# Altium project Noise Toaster.PrjPcb (part 2 of 3)

## Sheet Audio Amplifier.SchDoc: Audio Amplifier
size Letter; SheetNumber: 4; SheetTotal: 10
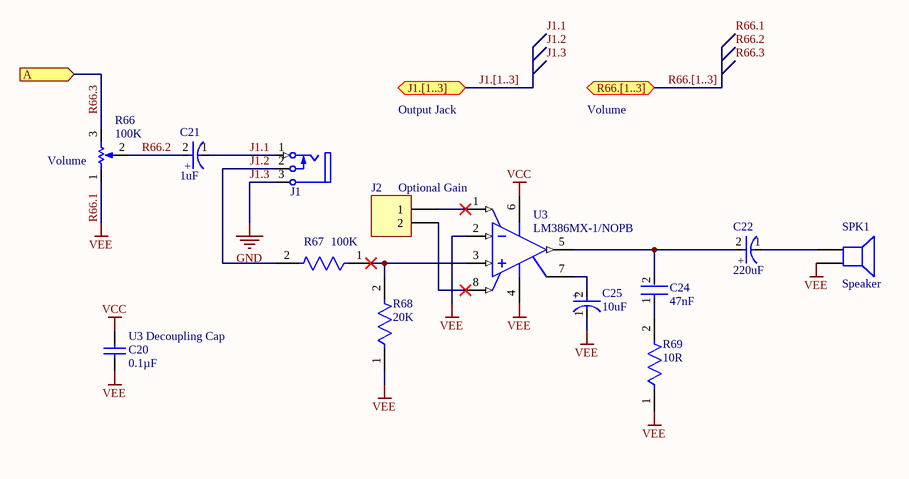
[diagram p5: Audio Amplifier.SchDoc]

### Parts
C20  Capacitance: 0.1µF  [SAMS-C0603-2_M]  (hidden comment: CL10B104KB8NNNC)
C21  Capacitance: 1uF  [FP-OS-CON-SMT-A5-MFG]  (hidden comment: EEE-1HA010NR)
C22  Capacitance: 220uF  [FP-SD-MFG]
C24  Capacitance: 47nF  [FP-CL10-IPC_A]  (hidden comment: CL10B473KB8NNNC)
C25  Capacitance: 10uF  [FP-OS-CON-SMT-A5-MFG]  (hidden comment: 865080440002)
J1  Phonejack2 TN  [JACK/6-V3A]  (value not drawn)  (graphical)
J2  Optional Gain  [HDR1X2]
R66  Volume  value 100K  [VR5]  (graphical)
R67  Resistance: 100K  [FP-ESR03-IPC_B]  (hidden comment: ESR03EZPJ104)
R68  Resistance: 20K  [FP-ESR03-IPC_B]  (hidden comment: ESR03EZPJ203)
R69  Resistance: 10R  [FP-ESR03-IPC_B]  (hidden comment: ESR03EZPJ100)
SPK1  Speaker  [PIN2]
U3  LM386MX-1/NOPB  [TI-D8_L]

### Ports
A (in), J1.[1..3] (bidir), R66.[1..3] (bidir)

### Nets
GND: J1.3(S)  [also labelled J1.3]
VCC: C20.2 U3.6(VS)
VEE: C20.1 C25.1(C) R66.1(TOP) R68.1 R69.1 SPK1.2 U3.2(IN-) U3.4(GND)  [also labelled R66.1]
J1.1: C21.1(C) J1.1(T)
J1.2: J1.2(TN) R67.2
R66.2: C21.2(A) R66.2(TAP)
R66.3: R66.3(BOT) ; port A  [project net A]
NetC22_1: C22.1(C) SPK1.1
NetC22_2: C22.2(A) C24.2 U3.5(VOUT)
NetC24_1: C24.1 R69.2
NetC25_2: C25.2(A) U3.7(BYPASS)
NetJ2_1: J2.1 U3.1(GAIN)
NetJ2_2: J2.2 U3.8(GAIN)
NetR67_1: R67.1 R68.2 U3.3(IN+)

### Buses and harness runs
bus J1.[1..3] = port J1.[1..3]
bus R66.[1..3] = port R66.[1..3]

### Notes on the sheet
- Output Jack
- Volume
- (near C20) U3 Decoupling Cap
- Labels drawn without touching a wire or pin: J1.1, J1.2, J1.3, R66.1, R66.2, R66.3
- (in symbol CMP-05427-000006-1) +
- (in symbol CMP-05427-000158-1) +

### Library data of the parts
C20 = CMP-2000-05332-1: Multi-layer Ceramic Capacitor, -55 to 125 degC, 2-Pin SMD (0603), RoHS, Tape and Reel; Manufacturer: Samsung Electro-Mechanics; Rated Voltage: 50V; Dielectric: X7R; Tolerance (%): ±10%; Case Size/Dimension: 0603; Datasheet URL: https://datasheet.ciiva.com/29198/456651-da-01-en-vs-kondensator-0605-29198839.pdf; Manufacturer URL: http://www.samsungsem.com/global/index.jsp; Datasheet Version: Nov-10
C21 = CMP-05427-000158-1: CAP ALUM POLY 10UF 20% 10V SMD Non-Polarized; Manufacturer: Panasonic; Ripple Current: 700mA; Polarity: Polar; ESR (Equivalent Series Resistance): 220mR; Leakage Current: 50uA; Material: Polymer; Voltage Rating: 50V; Life (Hours): 2000Hour; Dissipation Factor: 10%; Height - Seated (Max): 0.217inch; Height: 5.4mm; Length: 5.4mm; Case/Package: Radial; Number of Pins: 5; Voltage: 10V; Termination: SMD/SMT; Packaging: Tape and Reel; Mount: Surface Mount; Min Operating Temperature: -55°C; Voltage Rating (DC): 10V; Construction: Cylindrical; Series: OS-CON™, SVP; Max Operating Temperature: 105°C; Radiation Hardening: No; Diameter: 4mm; REACH SVHC: No SVHC; Ripple Current (AC): 700mA; RoHS Compliant: Yes; Tolerance: 20%; Package Quantity: 2000; Lead Free: Lead Free; Supplier 1: Mouser; Supplier Part Number 1: 667-EEE-1HA010NR; Manufacturer Part Number: EEE-1HA010NR; RoHS: Yes; Category: Aluminum Electrolytic Capacitors; Stock 1: 106; Pricing 1: 1=0.49000, 10=0.33900, 50=0.23700, 100=0.20300, 1000=0.15300, 10000=0.12100 (USD); Contact Plating: Tin; Width: 650um; ComponentLink1URL: https://datasheet.ciiva.com/24228/aba0000ce2-40801-24228231.pdf?src-supplier=Mouser; ComponentLink1Description: https://datasheet.ciiva.com/24228/aba0000ce2-40801-24228231.pdf?src-supplier=Mouser; ComponentLink2URL: https://datasheet.ciiva.com/14604/70255710-14604079.pdf?src-supplier=Allied+Electronics; ComponentLink2Description: https://datasheet.ciiva.com/14604/70255710-14604079.pdf?src-supplier=Allied+Electronics; ComponentLink3URL: https://datasheet.ciiva.com/14597/70255710-14597097.pdf?src-supplier=Allied+Electronics; ComponentLink3Description: https://datasheet.ciiva.com/14597/70255710-14597097.pdf?src-supplier=Allied+Electronics; ComponentLink4URL: https://datasheet.ciiva.com/16396/aba0000ce2-16396566.pdf?src-supplier=Future+Electronics; ComponentLink4Description: https://datasheet.ciiva.com/16396/aba0000ce2-16396566.pdf?src-supplier=Future+Electronics; ComponentLink5URL: https://datasheet.ciiva.com/30244/11aba0000ce2-30244199.pdf?src-supplier=Onlinecomponents.com; ComponentLink5Description: https://datasheet.ciiva.com/30244/11aba0000ce2-30244199.pdf?src-supplier=Onlinecomponents.com
C22 = CMP-05427-000006-1: Manufacturer: Nichicon; Manufacturer Part Number: UCL1C221MCL1GS; Material: Aluminium; Tolerance: 20%; Voltage Rating: 16V; Ripple Current: 600mA; Impedance: 160mR; Leakage Current: 3uA; Life (Hours): 2000Hour; Dissipation Factor: 0.16%; Supplier 1: Arrow Electronics; Supplier Part Number 1: UCL1C221MCL1GS; RoHS: Yes; Category: Aluminum Electrolytic Capacitors; Stock 1: 77400; Pricing 1: 900=0.22420 (USD); Mount: Surface Mount; Case/Package: Radial; Number of Pins: 2; Dielectric Material: Aluminium; Min Operating Temperature: -55°C; Max Operating Temperature: 105°C; Package Quantity: 1; Packaging: Tape and Reel; Voltage Rating (DC): 16V; Termination: SMD/SMT; Ripple Current (AC): 600mA; ESR (Equivalent Series Resistance): 160mR; Series: CL; Construction: Cylindrical; Diameter: 6.3mm; Length: 7.7mm; Height: 7.7mm; Height - Seated (Max): 0.303inch; Radiation Hardening: No; REACH SVHC: No SVHC; Lead Free: Lead Free; RoHS Compliant: Yes; ComponentLink1URL: https://datasheet.ciiva.com/101/e-cl-101761.pdf?src-supplier=Digi-Key; ComponentLink1Description: https://datasheet.ciiva.com/101/e-cl-101761.pdf?src-supplier=Digi-Key; ComponentLink2URL: https://datasheet.ciiva.com/101/e-cl-101762.pdf?src-supplier=Digi-Key; ComponentLink2Description: https://datasheet.ciiva.com/101/e-cl-101762.pdf?src-supplier=Digi-Key; ComponentLink3URL: https://datasheet.ciiva.com/101/e-cl-101763.pdf?src-supplier=Digi-Key; ComponentLink3Description: https://datasheet.ciiva.com/101/e-cl-101763.pdf?src-supplier=Digi-Key; ComponentLink4URL: https://datasheet.ciiva.com/11684/e-cl-11684891.pdf?src-supplier=Avnet; ComponentLink4Description: https://datasheet.ciiva.com/11684/e-cl-11684891.pdf?src-supplier=Avnet; ComponentLink5URL: https://datasheet.ciiva.com/16502/e-cl-16502283.pdf?src-supplier=Future+Electronics; ComponentLink5Description: https://datasheet.ciiva.com/16502/e-cl-16502283.pdf?src-supplier=Future+Electronics
C24 = CMP-13271-001056-1: Cap Ceramic 47nF 50V X7R ±10% Pad SMD 0603 +125°C T/R; Dielectric: Y5V; Packaging: Tape and Reel; Material: Ceramic; Max Operating Temperature: 125°C; Case/Package: 0603; Voltage Rating: 50V; Tolerance: 10%; Voltage: 50V; Height: 0.8mm; Mount: Surface Mount; Min Operating Temperature: -55°C; Package Quantity: 4000; Length: 1.6mm; Depth: 0.8mm; Lead Free: Lead Free; Case Code (Metric): 1608; Width: 0.031inch; Thickness: 0.035inch; Case Code (Imperial): 0603; Radiation Hardening: No; Voltage Rating (DC): 50V; Contact Plating: Tin
C25 = CMP-05427-000158-1: CAP ALUM POLY 10UF 20% 10V SMD; Manufacturer: Wurth Electronics; Voltage Rating: 25V; Polarity: Polar; Ripple Current: 85mA; Impedance: 2.1R; Life (Hours): 2000Hour; Supplier 1: RSComponents; Supplier Part Number 1: 8391799P; Manufacturer Part Number: 865080440002; RoHS: Yes; Category: Aluminum Electrolytic Capacitors; Stock 1: 1; Pricing 1: 25=0.18500, 125=0.12700, 250=0.11600, 500=0.10400 (USD); Mount: Surface Mount; Case/Package: Radial; Min Operating Temperature: -55°C; Max Operating Temperature: 105°C; Package Quantity: 2000; Packaging: Cut Tape; Ripple Current (AC): 85mA; Tolerance: 20%; Voltage Rating (DC): 25V; Diameter: 4mm; Height: 5.5mm; Height - Seated (Max): 0.217inch; REACH SVHC: Unknown; RoHS Compliant: Yes; ComponentLink1URL: http://www.farnell.com/datasheets/1880137.pdf?src-supplier=Farnell; ComponentLink1Description: http://www.farnell.com/datasheets/1880137.pdf?src-supplier=Farnell; ComponentLink2URL: http://www.farnell.com/datasheets/1880137.pdf?src-supplier=Element14; ComponentLink2Description: http://www.farnell.com/datasheets/1880137.pdf?src-supplier=Element14; ComponentLink3URL: https://katalog.we-online.de/pbs/datasheet/865080440002.pdf?src-supplier=Digi-Key; ComponentLink3Description: https://katalog.we-online.de/pbs/datasheet/865080440002.pdf?src-supplier=Digi-Key; ComponentLink4URL: http://katalog.we-online.de/pbs/datasheet/865080440002.pdf?src-supplier=Digi-Key; ComponentLink4Description: http://katalog.we-online.de/pbs/datasheet/865080440002.pdf?src-supplier=Digi-Key
J1 = Phonejack2 TN: Jack Socket, 1/4" [6.5mm], Thru-Hole, Vertical, 2-Conductor with Tip closed; PackageDocument: 2003; PCB_Layout: Complies with manufacturer's recommendation.; DrillAndSlotSize: Corresponds to nominal value.; ComponentLink1URL: http://www.cliffuk.co.uk/; ComponentLink1Description: Manufacturer Link; LatestRevisionDate: 15-Jul-2004; LatestRevisionNote: Component Replaced & renamed from "Phonejack".; DatasheetDocument: 2003; PackageReference: S1VS_SNB; Publisher: Altium Limited
J2 = Header 2: Header, 2-Pin; LatestRevisionDate: 17-Jul-2002; LatestRevisionNote: Re-released for DXP Platform.; Publisher: Altium Limited
R66 = RPot: Potentiometer; Sim Note: Enter the Resistance value and the set point into parameter fields.; Set Position: 0.5; Published: 8-Jun-2000; LatestRevisionDate: 17-Jul-2002; LatestRevisionNote: Re-released for DXP Platform.; PackageReference: VR5; Publisher: Altium Limited; PackageDescription: Variable Resistor, Thru-Hole; 3 Leads
R67 = CMP-08839-029521-1: 100kΩ ±5% 0.25W 0603 Anti-Surge Chip Resistor AEC-Q200; Power Rating: 200mW; Max Power Dissipation: 250mW; Temperature Coefficient: 200ppm/°C; Length: 0.063inch; Case Code (Imperial): 0603; Case/Package: 0603; Resistor Type: Thick Film; Features: Automotive AEC-Q200; Package Quantity: 1; Width: 0.031inch; Packaging: Cut Tape; Min Operating Temperature: -55°C; Series: ESR; RoHS Compliant: Yes; Size Code: 0603; Tolerance: 5%; Height: 0.022inch; Max Operating Temperature: 155°C; Lead Free: Lead Free; Case Code (Metric): 1608; Number of Terminations: 2
R68 = CMP-08839-028532-1: 20kΩ ±5% 0.25W 0603 Anti-Surge Chip Resistor AEC-Q200; Temperature Coefficient: 200ppm/°C; Max Power Dissipation: 250mW; Resistor Type: Thick Film; Number of Terminations: 2; Height: 0.022inch; Package Quantity: 5000; Case/Package: 0603; Packaging: Cut Tape; Case Code (Imperial): 0603; Width: 0.031inch; Max Operating Temperature: 155°C; Length: 0.063inch; Features: Automotive AEC-Q200; Case Code (Metric): 1608; Tolerance: 5%; Series: ESR; Min Operating Temperature: -55°C
R69 = CMP-08839-028230-1: 10Ω ±5% 0.25W 0603 Anti-Surge Chip Resistor AEC-Q200; Max Power Dissipation: 250mW; Temperature Coefficient: 200ppm/°C; Features: Automotive AEC-Q200; Packaging: Tape and Reel; Series: ESR; Tolerance: 5%; Min Operating Temperature: -55°C; Case Code (Imperial): 0603; RoHS Compliant: Yes; Resistor Type: Thick Film; Case/Package: 0603; Max Operating Temperature: 155°C; Number of Terminations: 2; Case Code (Metric): 1608
SPK1 = Speaker: Loudspeaker; Published: 24-Mar-1999; LatestRevisionDate: 17-Jul-2002; LatestRevisionNote: Re-released for DXP Platform.; PackageReference: PIN2; Publisher: Altium Limited
U3 = CMP-0994-00003-1: Low Voltage Audio Power Amplifier, 0 to 70 degC, 8-pin SOIC (D8), Green (RoHS & no Sb/Br); Manufacturer: Texas Instruments; SubFamily: Mid/High-Power Amplifier; Max. Number of Speaker Outputs: 1; Input Type: Analog; Mounting Technology: Surface Mount; ComponentLink1Description: Manufacturer URL; PackageVersion: 4040047-3/M, 06/2011; ComponentLink2URL: http://www.ti.com/general/docs/lit/getliterature.tsp?genericPartNumber=LM386&fileType=pdf; ComponentLink1URL: http://www.ti.com/; PackageDescription: 8-Pin Plastic Small Outline, Body 4.9 x 3.9 mm, Pitch 1.27 mm; PartNumber: LM386MX-1/NOPB; ComponentLink3Description: Package Specification; Eco-Plan: Green (RoHS & no Sb/Br); DatasheetVersion: SNAS545A; Code_JEDEC: MS-012; ComponentLink3URL: http://www.ti.com/litv/pdf/msoi002j; ComponentLink2Description: Datasheet; PackageReference: D8

## Sheet VCO.SchDoc: Voltage Controlled Oscillator
size Letter; SheetNumber: 9; SheetTotal: 10
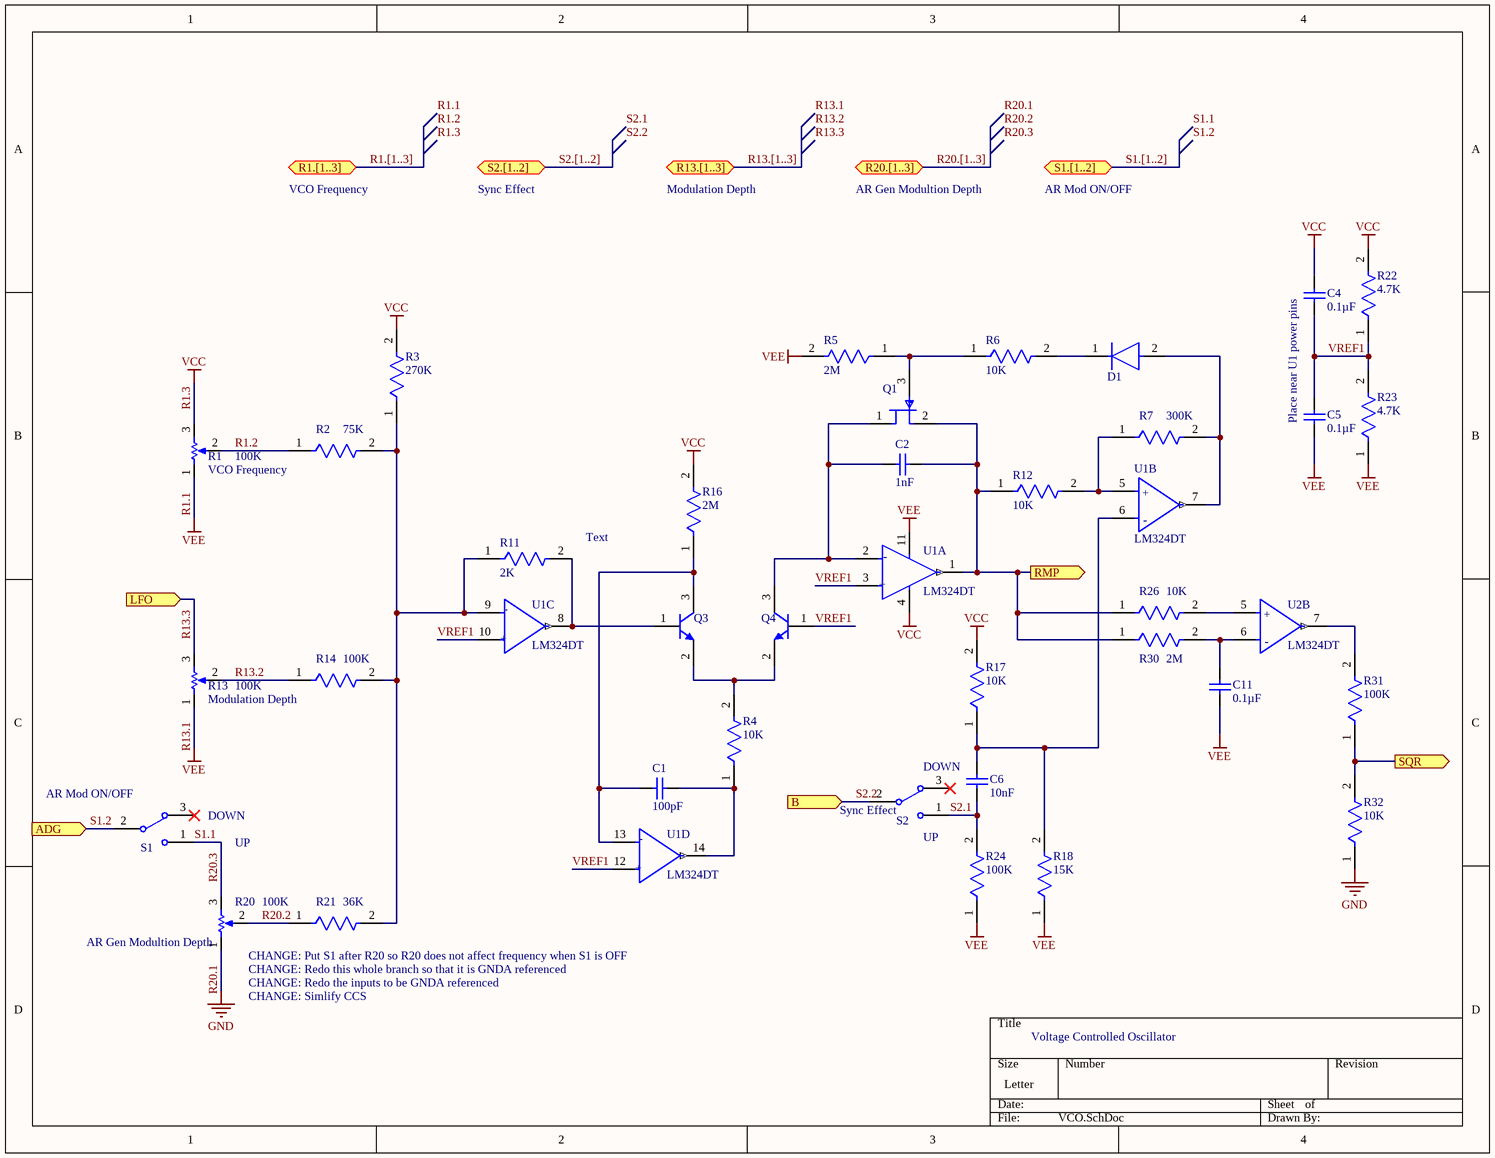
[diagram p6: VCO.SchDoc]

### Parts
C1  Capacitance: 100pF  [CAPC1608X90X35NL10T15]  (hidden comment: 885012206077‎)
C2  Capacitance: 1nF  [CAPC1608X90X35NL10T15]  (hidden comment: 885012206083‎)
C4  Capacitance: 0.1µF  [SAMS-C0603-2_M]  (hidden comment: CL10B104KB8NNNC)
C5  Capacitance: 0.1µF  [SAMS-C0603-2_M]  (hidden comment: CL10B104KB8NNNC)
C6  Capacitance: 10nF  [CAPC1608X90X35NL10T15]  (hidden comment: 885012206089)
C11  Capacitance: 0.1µF  [SAMS-C0603-2_M]  (hidden comment: CL10B104KB8NNNC)
D1  1N4448WS-7-F  [FP-SOD323-MFG]  (value not drawn)
Q1  MMBFJ113  [FP-318BM-IPC_C]  (value not drawn)
Q3  MMBT3904LT1G  [ONSC-SOT-23-3-318-08_V]  (value not drawn)
Q4  MMBT3904LT1G  [ONSC-SOT-23-3-318-08_V]  (value not drawn)
R1  VCO Frequency  value 100K  [VR5]  (graphical)
R2  Resistance: 75K  [FP-ESR03-IPC_B]  (hidden comment: ESR03EZPJ753)
R3  Resistance: 270K  [FP-ESR03-IPC_B]  (hidden comment: ESR03EZPJ274)
R4  Resistance: 10K  [FP-ESR03-IPC_B]  (hidden comment: ESR03EZPJ103)
R5  Resistance: 2M  [FP-ESR03-IPC_B]  (hidden comment: ESR03EZPJ205)
R6  Resistance: 10K  [FP-ESR03-IPC_B]  (hidden comment: ESR03EZPJ103)
R7  Resistance: 300K  [FP-ESR03-IPC_B]  (hidden comment: ESR03EZPJ304)
R11  Resistance: 2K  [FP-ESR03-IPC_B]  (hidden comment: ESR03EZPJ202)
R12  Resistance: 10K  [FP-ESR03-IPC_B]  (hidden comment: ESR03EZPJ103)
R13  Modulation Depth  value 100K  [VR5]  (graphical)
R14  Resistance: 100K  [FP-ESR03-IPC_B]  (hidden comment: ESR03EZPJ104)
R16  Resistance: 2M  [FP-ESR03-IPC_B]  (hidden comment: ESR03EZPJ205)
R17  Resistance: 10K  [FP-ESR03-IPC_B]  (hidden comment: ESR03EZPJ103)
R18  Resistance: 15K  [FP-ESR03-IPC_B]  (hidden comment: ESR03EZPJ153)
R20  AR Gen Modultion Depth  value 100K  [VR5]  (graphical)
R21  Resistance: 36K  [FP-ESR03-IPC_B]  (hidden comment: ESR03EZPJ363)
R22  Resistance: 4.7K  [FP-ESR03-IPC_B]  (hidden comment: ESR03EZPJ472)
R23  Resistance: 4.7K  [FP-ESR03-IPC_B]  (hidden comment: ESR03EZPJ472)
R24  Resistance: 100K  [FP-ESR03-IPC_B]  (hidden comment: ESR03EZPJ104)
R26  Resistance: 10K  [FP-ESR03-IPC_B]  (hidden comment: ESR03EZPJ103)
R30  Resistance: 2M  [FP-ESR03-IPC_B]  (hidden comment: ESR03EZPJ205)
R31  Resistance: 100K  [FP-ESR03-IPC_B]  (hidden comment: ESR03EZPJ104)
R32  Resistance: 10K  [FP-ESR03-IPC_B]  (hidden comment: ESR03EZPJ103)
S1  AR Mod ON/OFF  [HDR1X3]
S2  Sync Effect  [HDR1X3]
U1  LM324DT  [FP-SO-14-MFG]  (parts A,B,C,D of 4)
U2  LM324DT  [FP-SO-14-MFG]  (part B of 4)

### Ports
ADG (in), B (in), LFO (in), R1.[1..3] (bidir), R13.[1..3] (bidir), R20.[1..3] (bidir), RMP (out), S1.[1..2] (bidir), S2.[1..2] (bidir), SQR (out)

### Nets
GND: R20.1(TOP) R32.1  [also labelled R20.1]
VCC: C4.1 R1.3(BOT) R3.2 R16.2 R17.2 R22.2 U1.4(VCC+)  [also labelled R1.3]
VEE: C5.2 C11.1 R1.1(TOP) R5.2 R13.1(TOP) R18.1 R23.1 R24.1 U1.11(VCC-)  [also labelled R1.1, R13.1]
R1.2: R1.2(TAP) R2.1
R13.2: R13.2(TAP) R14.1
R13.3: R13.3(BOT) ; port LFO  [project net LFO]
R20.2: R20.2(TAP) R21.1
R20.3: R20.3(BOT) S1.1  [also labelled S1.1]
RMP: C2.2 Q1.2(S) R12.1 R26.1 R30.1 U1.1(Output_1) ; port RMP
S1.2: S1.2 ; port ADG  [project net ADG]
S2.1: C6.1 R24.2 S2.1
S2.2: S2.2 ; port B  [project net B]
S3.3: R31.1 R32.2 ; port SQR
VREF1: C4.2 C5.1 Q4.1(B) R22.1 R23.2 U1.3(Non-Inverting_Input_1) U1.10(Non-Inverting_Input_3) U1.12(Non-Inverting_Input_4)
NetC1_1: C1.1 Q3.3(C) R16.1 U1.13(Inverting_Input_4)
NetC1_2: C1.2 R4.1 U1.14(Output_4)
NetC2_1: C2.1 Q1.1(D) Q4.3(C) U1.2(Inverting_Input_1)
NetC6_2: C6.2 R17.1 R18.2 U1.6(Inverting_Input_2)
NetC11_2: C11.2 R30.2 U2.6(Inverting_Input_2)
NetD1_1: D1.1(C) R6.2
NetD1_2: D1.2(A) R7.2 U1.7(Output_2)
NetQ1_3: Q1.3(G) R5.1 R6.1
NetQ3_1: Q3.1(B) R11.2 U1.8(Output_3)
NetQ3_2: Q3.2(E) Q4.2(E) R4.2
NetR2_2: R2.2 R3.1 R11.1 R14.2 R21.2 U1.9(Inverting_Input_3)
NetR7_1: R7.1 R12.2 U1.5(Non-Inverting_Input_2)
NetR26_2: R26.2 U2.5(Non-Inverting_Input_2)
NetR31_2: R31.2 U2.7(Output_2)

Not connected (* = marked no-connect by the designer): S1 3*; S2 3*

### Buses and harness runs
bus R1.[1..3] = port R1.[1..3]
bus R13.[1..3] = port R13.[1..3]
bus R20.[1..3] = port R20.[1..3]
bus S1.[1..2] = port S1.[1..2]
bus S2.[1..2] = port S2.[1..2]

### Notes on the sheet
- VCO Frequency
- Sync Effect
- Modulation Depth
- AR Gen Modultion Depth
- AR Mod ON/OFF
- Place near U1 power pins
- (near R11) Text
- (near S2) DOWN
- (near S1) DOWN
- UP
- (near S2) UP
- CHANGE: Put S1 after R20 so R20 does not affect frequency when S1 is OFF
- CHANGE: Redo this whole branch so that it is GNDA referenced
- CHANGE: Redo the inputs to be GNDA referenced
- CHANGE: Simlify CCS
- Labels drawn without touching a wire or pin: R1.1, R1.2, R1.3, R13.1, R13.2, R13.3, R20.1, R20.2, R20.3, S1.1, S1.2, S2.1, S2.2
- (in symbol CMP-12131-000005-1, part A) -; +
- (in symbol CMP-12131-000005-1, part B) +; -
- (in symbol CMP-12131-000005-1, part C) -; +
- (in symbol CMP-12131-000005-1, part D) -; +

### Library data of the parts
C1 = CMP-2006-02891-1: Part Number: 885012206083‎; Manufacturer: Wurth; Manufacturer Part Number: 885012206083; Voltage Rating: 50V; Dielectric: X7R; Tolerance: 10%; Supplier 1: RSComponents; Supplier Part Number 1: 8392938; RoHS: Yes; Category: Ceramic Capacitors; Stock 1: 1; Pricing 1: 100=0.02300, 500=0.02000, 2000=0.01800, 4000=0.01600, 8000=0.00900 (USD); Mount: Surface Mount; Case/Package: 0603; Case Code (Metric): 1608; Case Code (Imperial): 0603; Min Operating Temperature: -55°C; Max Operating Temperature: 125°C; Packaging: Cut Tape; Voltage Rating (DC): 50V; Length: 0.063inch; Width: 0.031inch; Thickness: 0.037inch; REACH SVHC: Unknown; RoHS Compliant: Yes; ComponentLink1URL: http://www.farnell.com/datasheets/1958479.pdf?src-supplier=Farnell; ComponentLink1Description: http://www.farnell.com/datasheets/1958479.pdf?src-supplier=Farnell; ComponentLink2URL: http://www.farnell.com/datasheets/1958479.pdf?src-supplier=Element14; ComponentLink2Description: http://www.farnell.com/datasheets/1958479.pdf?src-supplier=Element14; ComponentLink3URL: https://katalog.we-online.de/pbs/datasheet/885012206083.pdf?src-supplier=Digi-Key; ComponentLink3Description: https://katalog.we-online.de/pbs/datasheet/885012206083.pdf?src-supplier=Digi-Key; ComponentLink4URL: http://www.farnell.com/datasheets/1958479.pdf?src-supplier=Newark; ComponentLink4Description: http://www.farnell.com/datasheets/1958479.pdf?src-supplier=Newark; Supplier 2: RSComponents; Supplier Part Number 2: 8392916; Stock 2: 1; Pricing 2: 100=0.02600, 500=0.01800, 2000=0.01600, 4000=0.01000, 8000=0.01000 (USD); ComponentLink5URL: http://www.farnell.com/datasheets/1958478.pdf?src-supplier=Farnell; ComponentLink5Description: http://www.farnell.com/datasheets/1958478.pdf?src-supplier=Farnell; ComponentLink6URL: http://www.farnell.com/datasheets/1958478.pdf?src-supplier=Element14; ComponentLink6Description: http://www.farnell.com/datasheets/1958478.pdf?src-supplier=Element14; ComponentLink7URL: https://katalog.we-online.de/pbs/datasheet/885012206077.pdf?src-supplier=Digi-Key; ComponentLink7Description: https://katalog.we-online.de/pbs/datasheet/885012206077.pdf?src-supplier=Digi-Key; ComponentLink8URL: http://www.farnell.com/datasheets/1958478.pdf?src-supplier=Newark; ComponentLink8Description: http://www.farnell.com/datasheets/1958478.pdf?src-supplier=Newark
C2 = CMP-2006-02891-1: Manufacturer: Wurth; Voltage Rating: 50V; Dielectric: X7R; Tolerance: 10%; Part Number: 885012206083‎; Supplier 1: RSComponents; Supplier Part Number 1: 8392938; Manufacturer Part Number: 885012206083; RoHS: Yes; Category: Ceramic Capacitors; Stock 1: 1; Pricing 1: 100=0.02300, 500=0.02000, 2000=0.01800, 4000=0.01600, 8000=0.00900 (USD); Mount: Surface Mount; Case/Package: 0603; Case Code (Metric): 1608; Case Code (Imperial): 0603; Min Operating Temperature: -55°C; Max Operating Temperature: 125°C; Packaging: Cut Tape; Voltage Rating (DC): 50V; Length: 0.063inch; Width: 0.031inch; Thickness: 0.037inch; REACH SVHC: Unknown; RoHS Compliant: Yes; ComponentLink1URL: http://www.farnell.com/datasheets/1958479.pdf?src-supplier=Farnell; ComponentLink1Description: http://www.farnell.com/datasheets/1958479.pdf?src-supplier=Farnell; ComponentLink2URL: http://www.farnell.com/datasheets/1958479.pdf?src-supplier=Element14; ComponentLink2Description: http://www.farnell.com/datasheets/1958479.pdf?src-supplier=Element14; ComponentLink3URL: https://katalog.we-online.de/pbs/datasheet/885012206083.pdf?src-supplier=Digi-Key; ComponentLink3Description: https://katalog.we-online.de/pbs/datasheet/885012206083.pdf?src-supplier=Digi-Key; ComponentLink4URL: http://www.farnell.com/datasheets/1958479.pdf?src-supplier=Newark; ComponentLink4Description: http://www.farnell.com/datasheets/1958479.pdf?src-supplier=Newark
C4 C5 C11 = CMP-2000-05332-1: as C20 on sheet Audio Amplifier; Case Size/Dimension: 0603; Datasheet URL: https://datasheet.ciiva.com/29198/456651-da-01-en-vs-kondensator-0605-29198839.pdf; Manufacturer URL: http://www.samsungsem.com/global/index.jsp; Datasheet Version: Nov-10
C6 = CMP-2006-02891-1: Manufacturer: Wurth Electronics; Voltage Rating: 50V; Dielectric: X7R; Tolerance: 10%; ComponentLink1URL: http://www.farnell.com/datasheets/1958479.pdf?src-supplier=Farnell; ComponentLink1Description: http://www.farnell.com/datasheets/1958479.pdf?src-supplier=Farnell; ComponentLink2URL: http://www.farnell.com/datasheets/1958479.pdf?src-supplier=Element14; ComponentLink2Description: http://www.farnell.com/datasheets/1958479.pdf?src-supplier=Element14; ComponentLink3URL: https://katalog.we-online.de/pbs/datasheet/885012206083.pdf?src-supplier=Digi-Key; ComponentLink3Description: https://katalog.we-online.de/pbs/datasheet/885012206083.pdf?src-supplier=Digi-Key; ComponentLink4URL: http://www.farnell.com/datasheets/1958479.pdf?src-supplier=Newark; ComponentLink4Description: http://www.farnell.com/datasheets/1958479.pdf?src-supplier=Newark; ComponentLink5URL: http://www.farnell.com/datasheets/1958478.pdf?src-supplier=Farnell; ComponentLink5Description: http://www.farnell.com/datasheets/1958478.pdf?src-supplier=Farnell; ComponentLink6URL: http://www.farnell.com/datasheets/1958478.pdf?src-supplier=Element14; ComponentLink6Description: http://www.farnell.com/datasheets/1958478.pdf?src-supplier=Element14; ComponentLink7URL: https://katalog.we-online.de/pbs/datasheet/885012206077.pdf?src-supplier=Digi-Key; ComponentLink7Description: https://katalog.we-online.de/pbs/datasheet/885012206077.pdf?src-supplier=Digi-Key; ComponentLink8URL: http://www.farnell.com/datasheets/1958478.pdf?src-supplier=Newark; ComponentLink8Description: http://www.farnell.com/datasheets/1958478.pdf?src-supplier=Newark; Supplier 1: RSComponents; Supplier Part Number 1: 8392950; Manufacturer Part Number: 885012206089; RoHS: Yes; Category: Ceramic Capacitors; Stock 1: 1; Pricing 1: 100=0.02100, 500=0.02000, 1000=0.01800, 2500=0.01800, 5000=0.01500 (USD); Mount: Surface Mount; Case/Package: 0603; Case Code (Metric): 1608; Case Code (Imperial): 0603; Min Operating Temperature: -55°C; Max Operating Temperature: 125°C; Packaging: Cut Tape; Voltage Rating (DC): 50V; Length: 0.063inch; Width: 0.031inch; Thickness: 0.037inch; REACH SVHC: Unknown; RoHS Compliant: Yes; ComponentLink9URL: http://www.farnell.com/datasheets/1958483.pdf?src-supplier=Farnell; ComponentLink9Description: http://www.farnell.com/datasheets/1958483.pdf?src-supplier=Farnell; ComponentLink10URL: http://www.farnell.com/datasheets/1958483.pdf?src-supplier=Element14; ComponentLink10Description: http://www.farnell.com/datasheets/1958483.pdf?src-supplier=Element14; ComponentLink11URL: https://katalog.we-online.de/pbs/datasheet/885012206089.pdf?src-supplier=Digi-Key; ComponentLink11Description: https://katalog.we-online.de/pbs/datasheet/885012206089.pdf?src-supplier=Digi-Key; ComponentLink12URL: http://www.farnell.com/datasheets/1958483.pdf?src-supplier=Newark; ComponentLink12Description: http://www.farnell.com/datasheets/1958483.pdf?src-supplier=Newark
D1 = CMP-12791-000011-1: DIODE GEN PURP 75V 250MA SOD323; Manufacturer: Diodes Incorporated; Forward Current: 500mA; Max Junction Temp: +150°C; Max Surge Forward Current: 0.5A; Value: 4pF; Peak Reverse Current: 2.5uA; Standoff Height: 0.05mm; ComponentLink2URL: https://www.diodes.com/assets/Datasheets/ds30096.pdf; ComponentLink2Description: Datasheet; Automotive: No; Temperature Range Low: -65°C; Package: SOD323; Temperature Range High: +150°C; Device Class L3: Rectifier Diodes; Reverse Voltage: 75V; Device Class L2: Diodes; Max Repetitive Reverse Voltage: 75V; Manufacturer Part Number: 1N4448WS-7-F; RoHS: TRUE; Lead Free: Yes; Temperature: -65°C to +150°C; Mouser Description: 1N4448WS Series 4 A 75 V 200 mW Surface Mount Fast Switching Diode - SOD-323; Capacitance: 4pF; Height: 1.2mm; Digikey Description: DIODE GEN PURP 75V 250MA SOD323; Octopart: https://octopart.com/1n4448ws-7-f-diodes+inc.-55389585; Footprint Url: https://www.diodes.com/assets/Package-Files/SOD323.pdf; Device Class L1: Discrete Semiconductors; Category: Diode
Q1 = CMP-07172-000001-1: JFET N-CH 35V 350MW SOT23; Manufacturer: ON Semiconductor; Number Of N Channels: 1; Gate To Source Voltage: -35V; Drain To Source Resistance: 100Ω; Standoff Height: 0mm; Rthja Max: 357°C/W; Max Junction Temp: +150°C; Gate to Source Voltage (Vgs): -25V; Element Configuration: Single; Input Capacitance: 7pF; Drain to Source Voltage (Vdss): 25V; Continuous Drain Current (ID): 5mA; Current Rating: 10mA; Polarity: N-CHANNEL; Device Class L2: Transistors; Number Of Channels: 1; ComponentLink2Description: Datasheet; Device Class L3: JFETs; Device Class L1: Discrete Semiconductors; Lead Free: Yes; Power Dissipation: 350mW; Category: Trans; Mouser Description: JFET N-Channel Switch; ComponentLink2URL: https://www.onsemi.com/pub/Collateral/MMBFJ113-D.PDF; RoHS: TRUE; Footprint Url: https://www.onsemi.com/pub/Collateral/318BM.PDF; Height: 1.2mm; Package: 318BM; Temperature Range High: +150°C; Manufacturer Part Number: MMBFJ113; Temperature: -55°C to +150°C; Digikey Description: JFET N-CH 35V 350MW SOT23; Temperature Range Low: -55°C; Octopart: https://octopart.com/mmbfj113-on+semiconductor-84330253; Automotive: No; Ipc Land Pattern Name: SOT95P240X120-3; Supplier 1: Digi-Key; Supplier Part Number 1: MMBF5457CT-ND; Stock 1: 13304; Pricing 1: 1=0.50000, 10=0.39000, 25=0.37280, 100=0.23400, 500=0.21670, 1000=0.14736 (USD); Mount: Surface Mount; Case/Package: SOT-23; Number of Pins: 3; Weight: 0.03g; Contact Plating: Tin,Matte; Min Operating Temperature: -55°C; Max Operating Temperature: 150°C; Packaging: Tape and Reel; Package Quantity: 1; Max Power Dissipation: 350mW; Voltage Rating (DC): 25V; Series: MMBF5457; Length: 2.92mm; Width: 1.3mm; Radiation Hardening: No; RoHS Compliant: Yes; REACH SVHC: No SVHC; ComponentLink1URL: https://datasheet.ciiva.com/25625/0900766b810cdc04-25625787.pdf?src-supplier=RSComponents; ComponentLink1Description: https://datasheet.ciiva.com/25625/0900766b810cdc04-25625787.pdf?src-supplier=RSComponents; ComponentLink3URL: https://datasheet.ciiva.com/8120/mmbf5459-8120391.pdf?src-supplier=Avnet; ComponentLink3Description: https://datasheet.ciiva.com/8120/mmbf5459-8120391.pdf?src-supplier=Avnet; ComponentLink4URL: https://datasheet.ciiva.com/26026/mmbf5459-26026568.pdf?src-supplier=Avnet+Europe; ComponentLink4Description: https://datasheet.ciiva.com/26026/mmbf5459-26026568.pdf?src-supplier=Avnet+Europe; ComponentLink5URL: https://datasheet.ciiva.com/960/mmbf5457-960906.pdf?src-supplier=Digi-Key; ComponentLink5Description: https://datasheet.ciiva.com/960/mmbf5457-960906.pdf?src-supplier=Digi-Key; ComponentLink6URL: https://datasheet.ciiva.com/960/mmbf5457-960907.pdf?src-supplier=Digi-Key; ComponentLink6Description: https://datasheet.ciiva.com/960/mmbf5457-960907.pdf?src-supplier=Digi-Key; ComponentLink7URL: https://datasheet.ciiva.com/46445/46943-46445739.pdf?src-supplier=Element14; ComponentLink7Description: https://datasheet.ciiva.com/46445/46943-46445739.pdf?src-supplier=Element14; ComponentLink8URL: https://datasheet.ciiva.com/960/mmbf5457-960908.pdf?src-supplier=Digi-Key; ComponentLink8Description: https://datasheet.ciiva.com/960/mmbf5457-960908.pdf?src-supplier=Digi-Key; ComponentLink9URL: https://datasheet.ciiva.com/3304/mmbf5459-3304349.pdf?src-supplier=Avnet; ComponentLink9Description: https://datasheet.ciiva.com/3304/mmbf5459-3304349.pdf?src-supplier=Avnet
Q3 Q4 = CMP-1048-00631-1: General Purpose Transistor, NPN Silicon, 3-Pin SOT-23, Pb-Free, Tape and Reel; Manufacturer: On Semiconductor; Manufacturer Part Number: MMBT3904,215; IC Continuous (A): 0.2; fT Min (MHz): 300; ComponentLink2Description: Datasheet; Polarity: NPN; PackageDescription: 3-Pin Small Outline Transistor, Body 2.92 x 1.3 mm, Pitch 0.95 mm; ComponentLink2URL: http://www.onsemi.cn/pub_link/Collateral/MMBT3904LT1-D.PDF; DatasheetVersion: Rev. 12; Mounting Technology: Surface Mount; PartNumber: MMBT3904LT1G; ComponentLink1URL: http://www.onsemi.com/; ComponentLink3Description: Package Specification; ComponentLink1Description: Manufacturer URL; PackageVersion: Rev. AP, 11/2009; PackageReference: SOT-23-3-318-08; Packing: Tape and Reel; ComponentLink3URL: http://www.onsemi.cn/pub_link/Collateral/318-08.PDF; RoHS: TRUE; Supplier 1: Digi-Key; Supplier Part Number 1: 1727-4044-1-ND; Category: BJTs; Stock 1: 165643; Pricing 1: 1=0.10000, 10=0.06500, 25=0.06200, 100=0.03500, 500=0.02750, 1000=0.01910 (USD); RoHS Compliant: Yes; ComponentLink4URL: http://www.farnell.com/datasheets/2328888.pdf?src-supplier=Farnell; ComponentLink4Description: http://www.farnell.com/datasheets/2328888.pdf?src-supplier=Farnell; ComponentLink5URL: https://assets.nexperia.com/documents/data-sheet/MMBT3904.pdf?src-supplier=Digi-Key; ComponentLink5Description: https://assets.nexperia.com/documents/data-sheet/MMBT3904.pdf?src-supplier=Digi-Key; ComponentLink6URL: http://www.farnell.com/datasheets/2328888.pdf?src-supplier=Newark; ComponentLink6Description: http://www.farnell.com/datasheets/2328888.pdf?src-supplier=Newark
R1 R13 R20 = RPot: as R66 on sheet Audio Amplifier; Published: 8-Jun-2000; LatestRevisionDate: 17-Jul-2002; LatestRevisionNote: Re-released for DXP Platform.; PackageReference: VR5; Publisher: Altium Limited; PackageDescription: Variable Resistor, Thru-Hole; 3 Leads
R2 = CMP-08839-028281-1: 75kΩ ±5% 0.25W 0603 Anti-Surge Chip Resistor AEC-Q200; Temperature Coefficient: 200ppm/°C; Max Power Dissipation: 250mW; Min Operating Temperature: -55°C; Number of Terminations: 2; Tolerance: 5%; Height: 0.022inch; Case Code (Metric): 1608; Width: 0.031inch; Case Code (Imperial): 0603; Package Quantity: 5000; Length: 0.063inch; Series: ESR; RoHS Compliant: Yes; Resistor Type: Thick Film; Packaging: Tape and Reel; Features: Automotive AEC-Q200; Max Operating Temperature: 155°C; Case/Package: 0603
R3 = CMP-08839-005369-1: 270kΩ ±5% 0.25W 0603 Anti-Surge Chip Resistor AEC-Q200; Temperature Coefficient: 200ppm/°C; Max Power Dissipation: 250mW; Case Code (Imperial): 0603; Series: ESR; Case Code (Metric): 1608; Features: Automotive AEC-Q200; Width: 0.031inch; Tolerance: 5%; Length: 0.063inch; Number of Terminations: 2; Packaging: Cut Tape; Height: 0.022inch; RoHS Compliant: Yes; Resistor Type: Thick Film; Max Operating Temperature: 155°C; Package Quantity: 5000; Case/Package: 0603; Min Operating Temperature: -55°C
R4 R6 R12 R17 R26 R32 = CMP-08839-028975-1: 10kΩ ±5% 0.25W 0603 Anti-Surge Chip Resistor AEC-Q200; Power Rating: 250mW; Temperature Coefficient: 200ppm/°C; Tolerance: 5%; Series: ESR03; Package Quantity: 5000; Length: 0.063inch; Height: 0.022inch; Lead Free: Lead Free; Case/Package: 0603; Case Code (Metric): 1608; Width: 0.031inch; Resistor Type: Thick Film; Max Power Dissipation: 250mW; Packaging: Tape and Reel; Mount: Surface Mount; Number of Terminations: 2; Case Code (Imperial): 0603; Max Operating Temperature: 155°C; Min Operating Temperature: -55°C; RoHS Compliant: Yes
R5 R16 R30 = CMP-08839-028457-1: 2MΩ ±5% 0.25W 0603 Anti-Surge Chip Resistor AEC-Q200; Temperature Coefficient: 200ppm/°C; Max Power Dissipation: 250mW; Number of Terminations: 2; Resistor Type: Thick Film; Package Quantity: 5000; Height: 0.022inch; Features: Automotive AEC-Q200; Case/Package: 0603; Width: 0.031inch; Length: 0.063inch; Series: ESR; Min Operating Temperature: -55°C; Tolerance: 5%; Max Operating Temperature: 155°C; Case Code (Imperial): 0603; Case Code (Metric): 1608; RoHS Compliant: Yes; Packaging: Tape and Reel
R7 = CMP-08839-029018-1: 300kΩ ±5% 0.25W 0603 Anti-Surge Chip Resistor AEC-Q200; Max Power Dissipation: 250mW; Temperature Coefficient: 200ppm/°C; Package Quantity: 5000; Max Operating Temperature: 155°C; Resistor Type: Thick Film; Series: ESR; Case/Package: 0603; Packaging: Tape and Reel; Tolerance: 5%; Min Operating Temperature: -55°C; Height: 0.022inch; Case Code (Imperial): 0603; Case Code (Metric): 1608; Length: 0.063inch; Number of Terminations: 2; Width: 0.031inch; Features: Automotive AEC-Q200
R11 = CMP-08839-028910-1: 2kΩ ±5% 0.25W 0603 Anti-Surge Chip Resistor AEC-Q200; Max Power Dissipation: 250mW; Temperature Coefficient: 200ppm/°C; RoHS Compliant: Yes; Series: ESR; Height - Seated (Max): 0.022inch; Min Operating Temperature: -55°C; Height: 0.022inch; Case/Package: 0603; Max Operating Temperature: 155°C; Resistor Type: Thick Film; Tolerance: 5%; Case Code (Imperial): 0603; Number of Terminations: 2; Packaging: Tape and Reel; Package Quantity: 1; Features: Automotive AEC-Q200; Width: 0.032inch; Length: 0.063inch; Case Code (Metric): 1608
R14 R24 R31 = CMP-08839-029521-1: as R67 on sheet Audio Amplifier; Length: 0.063inch; Case Code (Imperial): 0603; Case/Package: 0603; Resistor Type: Thick Film; Features: Automotive AEC-Q200; Package Quantity: 1; Width: 0.031inch; Packaging: Cut Tape; Min Operating Temperature: -55°C; Series: ESR; RoHS Compliant: Yes; Size Code: 0603; Tolerance: 5%; Height: 0.022inch; Max Operating Temperature: 155°C; Lead Free: Lead Free; Case Code (Metric): 1608; Number of Terminations: 2
R18 = CMP-08839-029360-1: 15kΩ ±5% 0.25W 0603 Anti-Surge Chip Resistor AEC-Q200; Max Power Dissipation: 250mW; Temperature Coefficient: 200ppm/°C; Max Operating Temperature: 155°C; Package Quantity: 1; Height: 0.022inch; Width: 0.031inch; Case/Package: 0603; Case Code (Metric): 1608; Min Operating Temperature: -55°C; Resistor Type: Thick Film; Number of Terminations: 2; Tolerance: 5%; Series: ESR; Case Code (Imperial): 0603; RoHS Compliant: Yes; Features: Automotive AEC-Q200; Packaging: Tape and Reel; Length: 0.063inch
R21 = CMP-08839-001611-1: 36kΩ ±5% 0.25W 0603 Anti-Surge Chip Resistor AEC-Q200; Temperature Coefficient: 200ppm/°C; Max Power Dissipation: 250mW; Series: ESR; Case Code (Imperial): 0603; Features: Automotive AEC-Q200; Package Quantity: 5000; Case/Package: 0603; RoHS Compliant: Yes; Number of Terminations: 2; Width: 0.031inch; Packaging: Cut Tape; Resistor Type: Thick Film; Min Operating Temperature: -55°C; Case Code (Metric): 1608; Height: 0.022inch; Length: 0.063inch; Tolerance: 5%; Max Operating Temperature: 155°C
R22 R23 = CMP-08839-007853-1: 4.7kΩ ±5% 0.25W 0603 Anti-Surge Chip Resistor AEC-Q200; Max Power Dissipation: 250mW; Temperature Coefficient: 200ppm/°C; Packaging: Tape and Reel; Series: ESR; Height: 0.022inch; Case Code (Imperial): 0603; Tolerance: 5%; RoHS Compliant: Yes; Case/Package: 0603; Min Operating Temperature: -55°C; Resistor Type: Thick Film; Package Quantity: 5000; Features: Automotive AEC-Q200; Width: 0.031inch; Length: 0.063inch; Max Operating Temperature: 155°C; Number of Terminations: 2
S1 S2 = SW-SPDT: Switch Toggle ON None ON SPDT Round Lever Solder Lug 5A 250VAC 28VDC Panel Mount with Threads; Manufacturer: E-Switch; Manufacturer Part Number: 100SP1T1B1M1QEH; Actuator Material: Brass,Chrome; Actuator Color: Chrome; Voltage Rating (AC): 120V; Voltage Rating (DC): 28V; Max Voltage Rating (AC): 250V; Illumination Type: Illuminated,Non-Illuminated; Switch Function: On-On; Actuator Type: Standard Round; Contact Resistance: 100mR; Electrical Life: 40000Cycles; Actuator Length: 10.41mm; Supplier 1: Newark; Supplier Part Number 1: 15N9971; RoHS: Yes; Category: Toggle Switches; Stock 1: 978; Pricing 1: 1=3.08000, 10=2.76000, 25=2.61000, 50=2.49000, 100=2.37000 (USD); Mount: Panel; Contact Material: Copper Alloy,Silver; Contact Plating: Silver; Housing Material: Stainless Steel; Min Operating Temperature: -30°C; Max Operating Temperature: 85°C; Throw Configuration: SPDT; Current Rating: 5A; Package Quantity: 1; Packaging: Bulk; Max Voltage Rating (DC): 28V; Termination: Solder; Orientation: Straight; Series: 100; REACH SVHC: No SVHC; Lead Free: Lead Free; RoHS Compliant: Yes; ComponentLink1URL: https://datasheet.ciiva.com/2904/st110007c-2904798.pdf?src-supplier=Digi-Key; ComponentLink1Description: https://datasheet.ciiva.com/2904/st110007c-2904798.pdf?src-supplier=Digi-Key; ComponentLink2URL: https://datasheet.ciiva.com/16154/xt0157p-16154561.pdf?src-supplier=Onlinecomponents.com; ComponentLink2Description: https://datasheet.ciiva.com/16154/xt0157p-16154561.pdf?src-supplier=Onlinecomponents.com; ComponentLink3URL: https://datasheet.ciiva.com/16347/100-16347391.pdf?src-supplier=Future+Electronics; ComponentLink3Description: https://datasheet.ciiva.com/16347/100-16347391.pdf?src-supplier=Future+Electronics
U1 U2 = CMP-12131-000005-1: IC OPAMP GP 4 CIRCUIT 14SO; Manufacturer: STMicroelectronics; Voltage Gain: 100dB; Standoff Height: 0.1mm; Bandwidth: 1.3MHz; Max Junction Temp: +150°C; Min Supply Voltage: 3V; Max Dual Supply Voltage: 15V; Min Dual Supply Voltage: 1.5V; Number Of Channels: 4; Nominal Supply Current: 0.7-1.5mA; Output Current Per Channel: 20-50mA; Max Supply Voltage: 30V; Input Offset Voltage: 2mV; Input Bias Current: 0.02uA; Device Class L1: Integrated Circuits (ICs); Device Class L3: Amplifiers - Op Amps; Temperature Range Low: 0°C; Package: SO-14; Temperature Range High: +70°C; Digikey Description: IC OPAMP GP 4 CIRCUIT 14SO; Device Class L2: Linear ICs; Footprint Url: https://www.st.com/content/ccc/resource/technical/document/datasheet/group3/10/8a/e6/12/f8/e8/49/ce/DM00366438/files/DM00366438.pdf/jcr:content/translations/en.DM00366438.pdf; Octopart: https://octopart.com/lm324dt-stmicroelectronics-39579146; ComponentLink2URL: https://www.st.com/content/ccc/resource/technical/document/datasheet/bd/fc/46/43/26/8f/40/7f/CD00001046.pdf/files/CD00001046.pdf/jcr:content/translations/en.CD00001046.pdf; ComponentLink2Description: Datasheet; Lead Free: Yes; Temperature: 0°C to +70°C; RoHS: TRUE; Gain Bandwidth: 1.3MHz; Manufacturer Part Number: LM324DT; Automotive: No; Category: IC; Height: 1.75mm; Mouser Description: LM324 Series 32 V 1.3 MHz Low Power Quad Operational Amplifier - SOIC-14